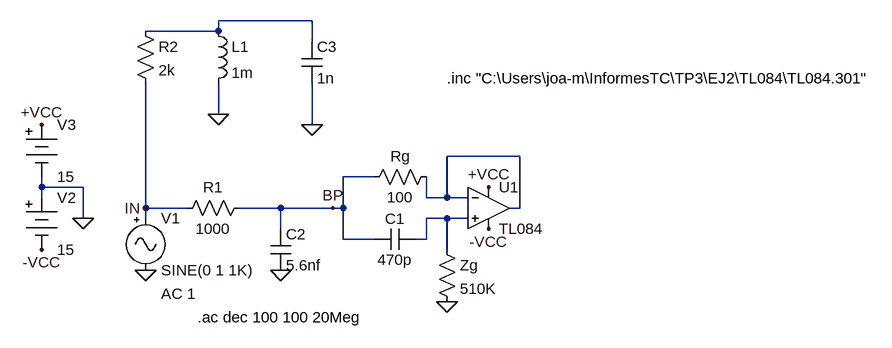
[diagram p0: schematic gyrator_bandpass.asc]
gyrator_bandpass.asc, the LTspice schematic file:
Version 4
SHEET 1 896 680
WIRE -96 -80 -240 -80
WIRE -240 -64 -240 -80
WIRE -240 -64 -352 -64
WIRE -96 -48 -96 -80
WIRE -240 64 -240 16
WIRE -96 80 -96 16
WIRE 224 128 112 128
WIRE 0 160 -48 160
WIRE -512 176 -512 160
WIRE -448 176 -512 176
WIRE -512 192 -512 176
WIRE 80 192 80 160
WIRE 112 192 112 128
WIRE 112 192 80 192
WIRE 144 192 112 192
WIRE -352 208 -352 16
WIRE -288 208 -352 208
WIRE -144 208 -208 208
WIRE -64 208 -144 208
WIRE -48 208 -48 160
WIRE -48 208 -64 208
WIRE 224 208 224 128
WIRE 224 208 208 208
WIRE -448 224 -448 176
WIRE -352 224 -352 208
WIRE 112 224 80 224
WIRE 144 224 112 224
WIRE -144 240 -144 208
WIRE -48 256 -48 208
WIRE 0 256 -48 256
WIRE 80 256 80 224
WIRE 80 256 64 256
WIRE 112 272 112 224
FLAG 112 352 0
FLAG -352 304 0
FLAG -512 80 +VCC
FLAG -512 272 -VCC
FLAG -448 224 0
FLAG -64 208 BP
FLAG -352 208 IN
FLAG 176 176 +VCC
FLAG 176 240 -VCC
FLAG -144 304 0
FLAG -240 64 0
FLAG -96 80 0
SYMBOL res 96 144 R90
WINDOW 0 0 56 VBottom 2
WINDOW 3 32 56 VTop 2
SYMATTR InstName Rg
SYMATTR Value 100
SYMBOL res 96 256 R0
SYMATTR InstName Zg
SYMATTR Value 510K
SYMBOL cap 64 240 R90
WINDOW 0 0 32 VBottom 2
WINDOW 3 32 32 VTop 2
SYMATTR InstName C1
SYMATTR Value 470p
SYMBOL res -192 192 R90
WINDOW 0 0 56 VBottom 2
WINDOW 3 32 56 VTop 2
SYMATTR InstName R1
SYMATTR Value 1000
SYMBOL Misc\\signal -352 208 R0
WINDOW 123 24 132 Left 2
WINDOW 39 0 0 Left 0
SYMATTR Value2 AC 1
SYMATTR InstName V1
SYMBOL Misc\\battery -512 176 R0
WINDOW 123 0 0 Left 0
WINDOW 39 0 0 Left 0
SYMATTR InstName V2
SYMATTR Value 15
SYMBOL Misc\\battery -512 64 R0
WINDOW 123 0 0 Left 0
WINDOW 39 0 0 Left 0
SYMATTR InstName V3
SYMATTR Value 15
SYMBOL Opamps\\opamp2 176 144 R0
SYMATTR InstName U1
SYMATTR Value TL084
SYMATTR SpiceModel TL084
SYMBOL cap -160 240 R0
SYMATTR InstName C2
SYMATTR Value 5.6nf
SYMBOL res -368 -80 R0
SYMATTR InstName R2
SYMATTR Value 2k
SYMBOL ind -256 -80 R0
SYMATTR InstName L1
SYMATTR Value 1m
SYMBOL cap -112 -48 R0
SYMATTR InstName C3
SYMATTR Value 1n
TEXT -272 376 Left 2 !.ac dec 100 100 20Meg
TEXT 112 8 Left 2 !.inc "C:\\Users\\joa-m\\InformesTC\\TP3\\EJ2\\TL084\\TL084.301"

The netlist it stands for:
* gyrator_bandpass.asc
Rg N002 BP 100
R§Zg N003 0 510K
C1 N003 BP 470p
R1 BP IN 1000
V1 IN 0 SINE(0 1 1K) AC 1
V2 0 -VCC 15
V3 +VCC 0 15
XU1 N003 N002 +VCC -VCC N002 TL084 TL084  ; pins In+ In- V+ V- OUT
C2 BP 0 5.6nf
R2 N001 IN 2k
L1 N001 0 1m
C3 N001 0 1n
.ac dec 100 100 20Meg
.inc "C:\Users\joa-m\InformesTC\TP3\EJ2\TL084\TL084.301"
.backanno
.end